# Altium schematic sheet LED.SchDoc
size A4
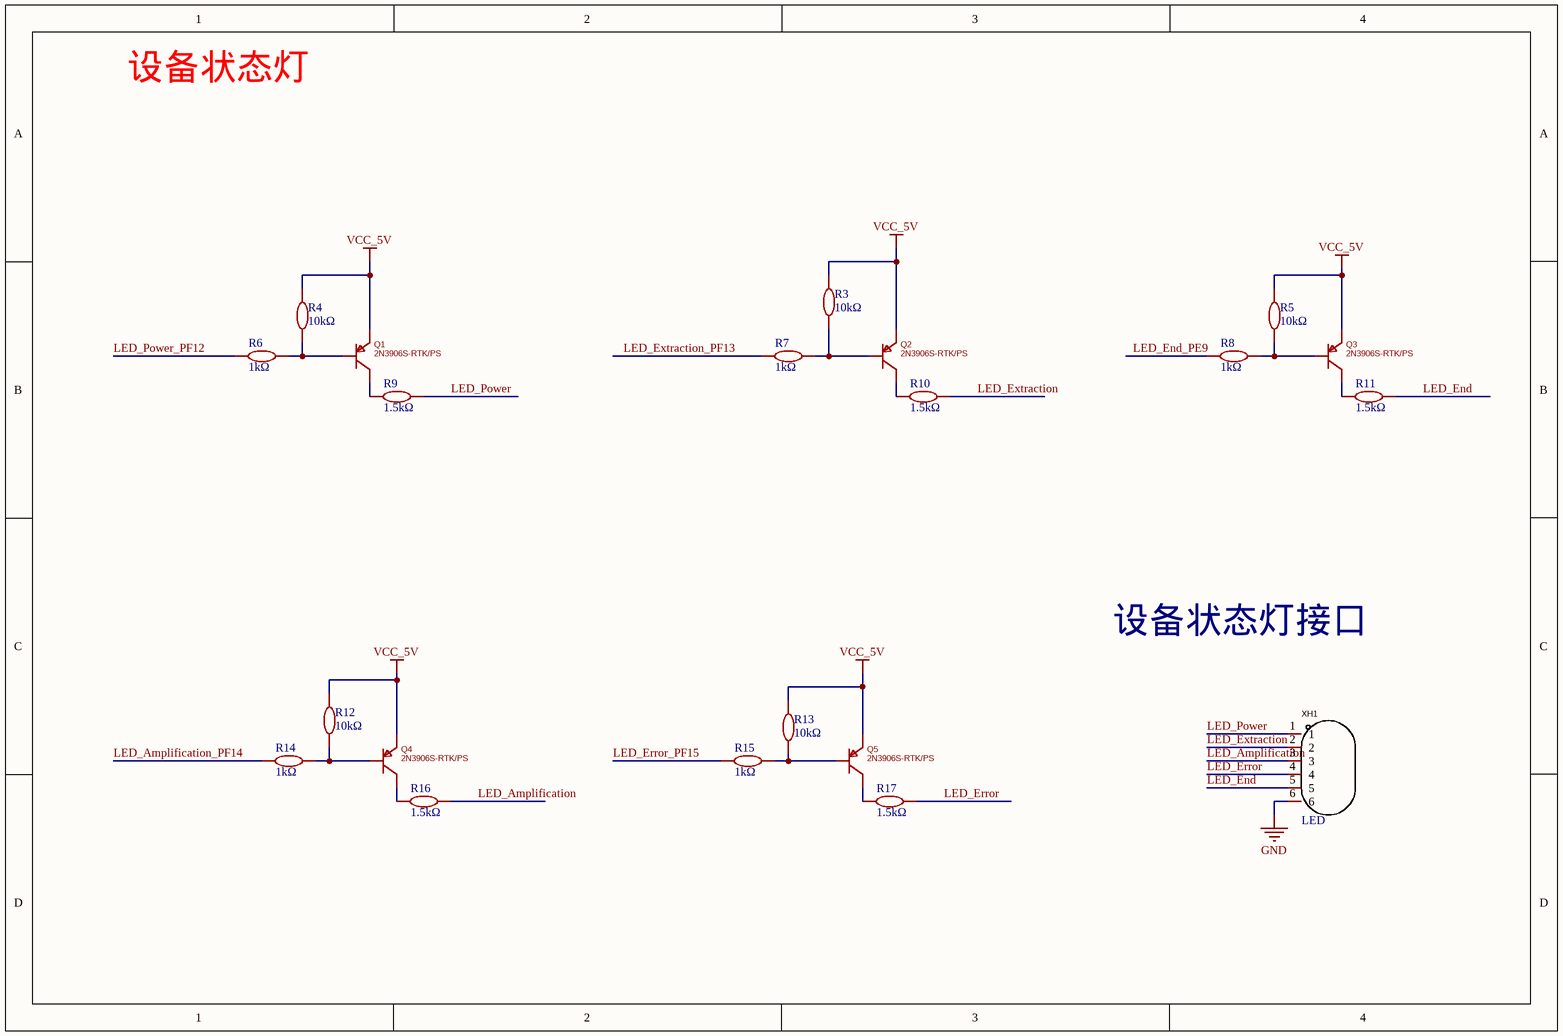
[diagram p0: LED.SchDoc]

## Parts
Q1  2N3906S-RTK/PS  [SOT-23-3_L2.9-W1.3-P1.90-LS2.4-TR]
Q2  2N3906S-RTK/PS  [SOT-23-3_L2.9-W1.3-P1.90-LS2.4-TR]
Q3  2N3906S-RTK/PS  [SOT-23-3_L2.9-W1.3-P1.90-LS2.4-TR]
Q4  2N3906S-RTK/PS  [SOT-23-3_L2.9-W1.3-P1.90-LS2.4-TR]
Q5  2N3906S-RTK/PS  [SOT-23-3_L2.9-W1.3-P1.90-LS2.4-TR]
R3  10kΩ  [R0603]
R4  10kΩ  [R0603]
R5  10kΩ  [R0603]
R6  1kΩ  [R0603]
R7  1kΩ  [R0603]
R8  1kΩ  [R0603]
R9  1.5kΩ  [R0603]
R10  1.5kΩ  [R0603]
R11  1.5kΩ  [R0603]
R12  10kΩ  [R0603]
R13  10kΩ  [R0603]
R14  1kΩ  [R0603]
R15  1kΩ  [R0603]
R16  1.5kΩ  [R0603]
R17  1.5kΩ  [R0603]
XH1  LED  [CONN-TH_6P-P2.00_S6B-PH-K-S-LF-SN]

## Nets
GND: XH1.6
VCC_5V: Q1.1(E) Q2.1(E) Q3.1(E) Q4.1(E) Q5.1(E) R3.2 R4.2 R5.2 R12.2 R13.2
LED_Amplification: R16.1 XH1.3
LED_Amplification_PF14: R14.2
LED_End: R11.1 XH1.5
LED_End_PE9: R8.2
LED_Error: R17.1 XH1.4
LED_Error_PF15: R15.2
LED_Extraction: R10.1 XH1.2
LED_Extraction_PF13: R7.2
LED_Power: R9.2 XH1.1
LED_Power_PF12: R6.2
NetQ1_2: Q1.2(B) R4.1 R6.1
NetQ1_3: Q1.3(C) R9.1
NetQ2_2: Q2.2(B) R3.1 R7.1
NetQ2_3: Q2.3(C) R10.2
NetQ3_2: Q3.2(B) R5.1 R8.1
NetQ3_3: Q3.3(C) R11.2
NetQ4_2: Q4.2(B) R12.1 R14.1
NetQ4_3: Q4.3(C) R16.2
NetQ5_2: Q5.2(B) R13.1 R15.1
NetQ5_3: Q5.3(C) R17.2

## Notes on the sheet
- 设备状态灯
- 设备状态灯接口

## Library data of the parts
Q1-Q5 = 2N3906S-RTK/PS: Manufacturer: KEC; Symbol: 2N3906S-RTK/PS_C5300004; Add into BOM: yes; Current - Collector(Ic): 200mA; Collector - Emitter Voltage VCEO: 40V; Pd - Power Dissipation: 350mW; DC Current Gain: 300@10mA,1V; Transition frequency(fT): 250MHz; Current - Collector Cutoff: 50nA; Vce Saturation(VCE(sat)): 400mV@50mA,5mA; Emitter-Base Voltage(Vebo): 5V; Device: 2N3906S-RTK/PS; LCSC Part Name: 2N3906S-RTK/PS; Supplier Part: C5300004; Manufacturer Part: 2N3906S-RTK/PS; Supplier Footprint: SOT-23; JLCPCB Part Class: Extended Part; Datasheet: https://item.szlcsc.com/datasheet/2N3906S-RTK%252FPS/6051230.html; Supplier: LCSC; Convert to PCB: yes
R3-R5 R12 R13 = 10kΩ,R0603: 电阻类型:厚膜电阻;阻值:10kΩ;精度:±1%;功率:100mW;最大工作电压:75V;温度系数:±100ppm/℃;
R6-R8 R14 R15 = 1kΩ,R0603: 电阻类型:厚膜电阻;阻值:1kΩ;精度:±1%;功率:125mW;最大工作电压:150V;温度系数:±100ppm/℃;
R9-R11 R16 R17 = 1.5kΩ,R0603: 电阻类型:厚膜电阻;阻值:1.5kΩ;精度:±1%;功率:100mW;最大工作电压:75V;温度系数:±100ppm/℃;
XH1 = S6B-PH-K-S(LF)(SN)